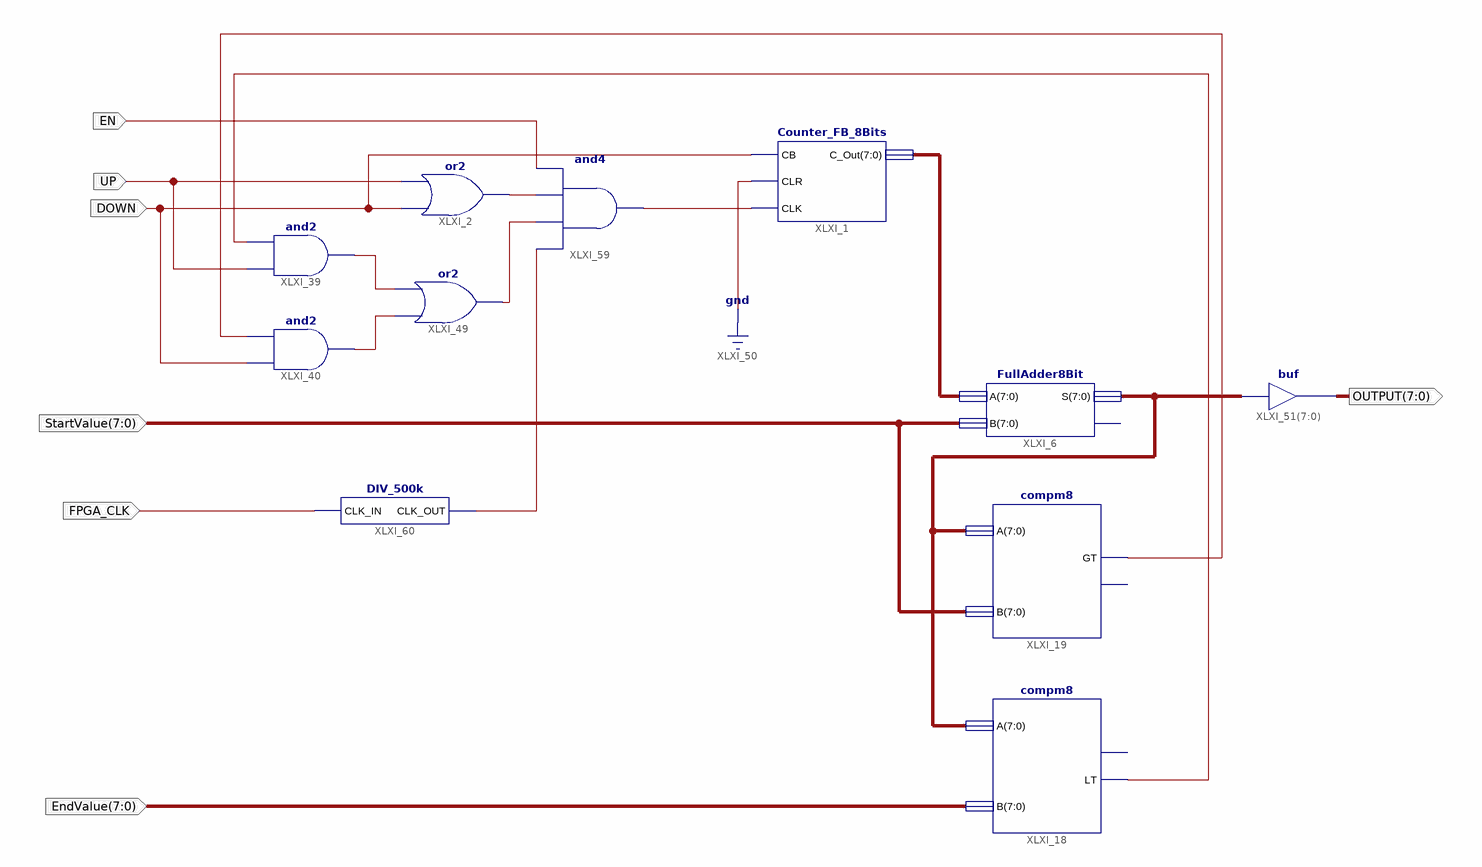
[diagram p0: schematic sheet 1]
// Xilinx ISE schematic ManualControl.sch (spartan6) as structural Verilog: 11 symbols, 7 ports
module ManualControl (
  input  DOWN,
  input  UP,
  input  EN,
  input  [7:0] StartValue,
  input  [7:0] EndValue,
  input  FPGA_CLK,
  output [7:0] OUTPUT
);

  wire XLXN_114, XLXN_120, XLXN_121, XLXN_124, XLXN_199, XLXN_200, XLXN_245, XLXN_256;
  wire [7:0] XLXN_75, XLXN_209;

  Counter_FB_8Bits XLXI_1 (.CB(DOWN), .CLR(1'b0), .CLK(XLXN_256), .C_Out(XLXN_75));
  or XLXI_2 (XLXN_199, DOWN, UP);
  and XLXI_40 (XLXN_121, DOWN, XLXN_114);
  and XLXI_39 (XLXN_120, UP, XLXN_124);
  or XLXI_49 (XLXN_200, XLXN_121, XLXN_120);
  FullAdder8Bit XLXI_6 (.A(XLXN_75), .B(StartValue), .S(XLXN_209));  // open: CO
  assign OUTPUT = XLXN_209;  // buf XLXI_51[7..0], 8 bits wide
  compm8 XLXI_19 (.A(XLXN_209), .B(StartValue), .GT(XLXN_114));  // open: LT
  compm8 XLXI_18 (.A(XLXN_209), .B(EndValue), .LT(XLXN_124));  // open: GT
  and XLXI_59 (XLXN_256, XLXN_245, XLXN_200, XLXN_199, EN);
  DIV_500k XLXI_60 (.CLK_IN(FPGA_CLK), .CLK_OUT(XLXN_245));
endmodule
